# EAGLE design pinoccio-motion (EAGLE 7.1.0)
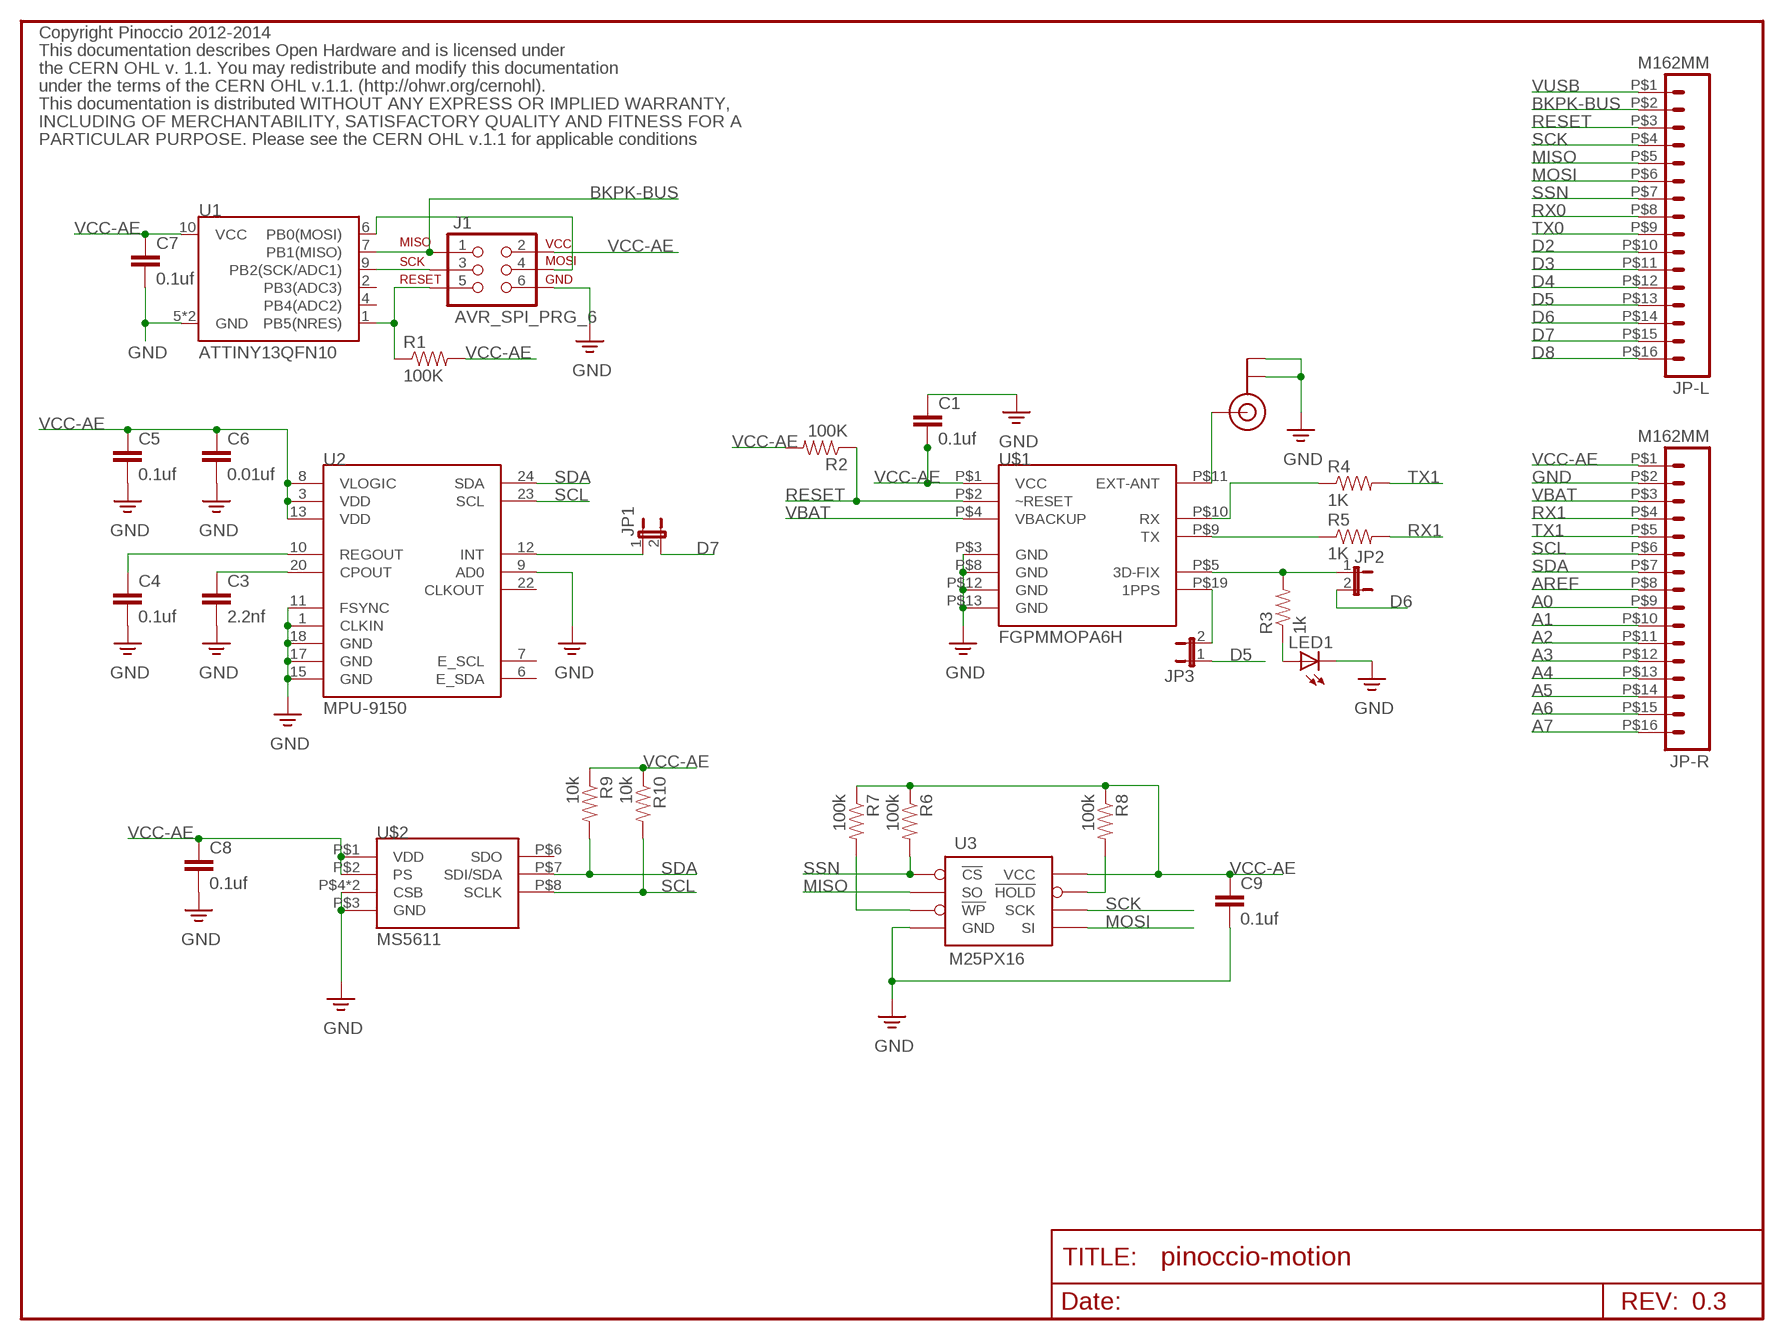
[diagram p0: schematic, sheet 1]

## Parts
C1  0.1uf  CAP0402-CAP  [0402-CAP]
C3  2.2nf  CAP0603-CAP  [0603-CAP]
C4  0.1uf  CAP0402-CAP  [0402-CAP]
C5  0.1uf  CAP0402-CAP  [0402-CAP]
C6  0.01uf  CAP0402-CAP  [0402-CAP]
C7  0.1uf  CAP0402-CAP  [0402-CAP]
C8  0.1uf  CAP0402-CAP  [0402-CAP]
C9  0.1uf  CAP0402-CAP  [0402-CAP]
J1  AVR_SPI_PRG_6  [2X3-PAD]
JP1  JUMPER-2SMD-NC  [SJ_2S]
JP2  JUMPER-2SMD-NC  [SJ_2S]
JP3  JUMPER-2SMD-NC  [SJ_2S]
JP-L  M162MM  [1X16_2MM]
JP-R  M162MM  [1X16_2MM]
LED1  LED0603  [LED-0603]
R1  100K  RESISTOR0402-RES  [0402-RES]
R2  100K  RESISTOR0402-RES  [0402-RES]
R3  1k  RESISTOR0402-RES  [0402-RES]
R4  1K  RESISTOR0402-RES  [0402-RES]
R5  1K  RESISTOR0402-RES  [0402-RES]
R6  100k  RESISTOR0402-RES  [0402-RES]
R7  100k  RESISTOR0402-RES  [0402-RES]
R8  100k  RESISTOR0402-RES  [0402-RES]
R9  10k  RESISTOR0402-RES  [0402-RES]
R10  10k  RESISTOR0402-RES  [0402-RES]
U1  ATTINY13QFN10  [QFN-10]
U2  MPU-9150  MPU-9150QFN-24-NP  [QFN-24-NP]
U3  M25PX16  M25PX16SO8N  [SO8N]
U$1  FGPMMOPA6H  [FGPMMOPA6H]
U$2  MS5611  [MS5611]
U$4  U.FL  [U.FL]

## Nets
A0: JP-R.P$9
A1: JP-R.P$10
A2: JP-R.P$11
A3: JP-R.P$12
A4: JP-R.P$13
A5: JP-R.P$14
A6: JP-R.P$15
A7: JP-R.P$16
AREF: JP-R.P$8
BKPK-BUS: J1.1 JP-L.P$2 U1.7(PB1(MISO))
D2: JP-L.P$10
D3: JP-L.P$11
D4: JP-L.P$12
D5: JP3.1 JP-L.P$13
D6: JP2.2 JP-L.P$14
D7: JP1.2 JP-L.P$15
D8: JP-L.P$16
GND [GND]: C1.1 C3.2 C4.2 C5.2 C6.2 C7.2 C8.2 C9.2 J1.6 JP-R.P$2 LED1.C U1.5(GND) U1.EP(GND) U2.1(CLKIN) U2.9(AD0) U2.11(FSYNC) U2.15(GND) U2.17(GND) U2.18(GND) U3.4(GND) U$1.P$3(GND) U$1.P$8(GND) U$1.P$12(GND) U$1.P$13(GND) U$2.P$3(GND) U$2.P$4(CSB) U$2.P$5(CSB) U$4.P$1(GND) U$4.P$2(GND)
MISO: JP-L.P$5 U3.2(SO)
MOSI: JP-L.P$6 U3.5(SI)
N$1: J1.4 U1.6(PB0(MOSI))
N$2: R4.1 U$1.P$10(RX)
N$3: J1.3 U1.9(PB2(SCK/ADC1))
N$4: J1.5 R1.1 U1.1(PB5(NRES))
N$5: U$1.P$11(EXT-ANT) U$4.P$3(SIGNAL)
N$6: R5.1 U$1.P$9(TX)
N$7: JP1.1 U2.12(INT)
N$8: C3.1 U2.20(CPOUT)
N$9: JP2.1 R3.2 U$1.P$5(3D-FIX)
N$10: JP3.2 U$1.P$19(1PPS)
N$11: C4.1 U2.10(REGOUT)
N$12: R7.2 U3.3(!WP)
N$13: R8.2 U3.7(!HOLD)
N$14: LED1.A R3.1
RESET: JP-L.P$3 R2.1 U$1.P$2(~RESET)
RX0: JP-L.P$8
RX1: JP-R.P$4 R5.2
SCK: JP-L.P$4 U3.6(SCK)
SCL: JP-R.P$6 R10.2 U2.23(SCL) U$2.P$8(SCLK)
SDA: JP-R.P$7 R9.2 U2.24(SDA) U$2.P$7(SDI/SDA)
SSN: JP-L.P$7 R6.2 U3.1(!CS)
TX0: JP-L.P$9
TX1: JP-R.P$5 R4.2
VBAT: JP-R.P$3 U$1.P$4(VBACKUP)
VCC-AE: C1.2 C5.1 C6.1 C7.1 C8.1 C9.1 J1.2 JP-R.P$1 R1.2 R2.2 R6.1 R7.1 R8.1 R9.1 R10.1 U1.10(VCC) U2.3(VDD) U2.8(VLOGIC) U2.13(VDD) U3.8(VCC) U$1.P$1(VCC) U$2.P$1(VDD) U$2.P$2(PS)
VUSB: JP-L.P$1
Unconnected: U1.2(PB3(ADC3)) U1.4(PB4(ADC2)) U2.6(E_SDA) U2.7(E_SCL) U2.22(CLKOUT) U$2.P$6(SDO)

## Notes on the sheet
- Copyright Pinoccio 2012-2014
- This documentation describes Open Hardware and is licensed under
- the CERN OHL v. 1.1. You may redistribute and modify this documentation
- under the terms of the CERN OHL v.1.1. (http://ohwr.org/cernohl).
- This documentation is distributed WITHOUT ANY EXPRESS OR IMPLIED WARRANTY,
- INCLUDING OF MERCHANTABILITY, SATISFACTORY QUALITY AND FITNESS FOR A
- PARTICULAR PURPOSE. Please see the CERN OHL v.1.1 for applicable conditions
- 0.3
- /Volumes/Data/Users/eric/Desktop/pinoccio.bmp
- /Volumes/Data/Users/eric/Desktop/pinoccio-1in.bmp | /Volumes/Data/Users/eric/Desktop/pinoccio-full-3-4in.bmp | /Volumes/Data/Users/eric/Desktop/pinoccio-full-3-4in.bmp

## Library data of the parts
C1 C3-C9 = Pinoccio:CAP: Capacitor Standard 0603 ceramic capacitor, and 0.1" leaded capacitor.
J1 = Pinoccio:AVR_SPI_PRG_6: AVR ISP 6 Pin This is the reduced ISP connector for AVR programming. Common on Arduino. This footprint will take up less PCB space and can be used with a 10-pin to 6-pin adapter such as SKU: BOB-08508
JP1-JP3 = Pinoccio:JUMPER-2: Jumper Basic 0.1" spaced jumper. Use with breakaway headers.
JP-L JP-R = Pinoccio:M16
LED1 = Pinoccio:LED: LEDs Standard schematic elements and footprints for 5mm, 3mm, 1206, and 0603 sized LEDs. 5mm - Spark Fun Electronics SKU : COM-00529 (and others)
R1-R10 = Pinoccio:RESISTOR: Resistor Basic schematic elements and footprints for 0603, 1206, and PTH resistors.
U1 = Pinoccio:ATTINY13
U2 = Pinoccio:MPU-9150: 9DOF (3mag, 3accel, 3rotat). I2C interface.
U3 = Pinoccio:M25PX16
U$1 = Pinoccio:FGPMMOPA6H
U$2 = Pinoccio:MS5611
U$4 = Pinoccio:U.FL: Hirose U.FL-R-SMT-1(10)

## Net classes
0 Default: width 0.203 mm
1 VCC: width 0.305 mm
2 LEDPower: width 0.203 mm
3 ButtonSignal: width 0.203 mm
4 RF Antenna: width 0.305 mm
5 GND: width 0.203 mm

## Board
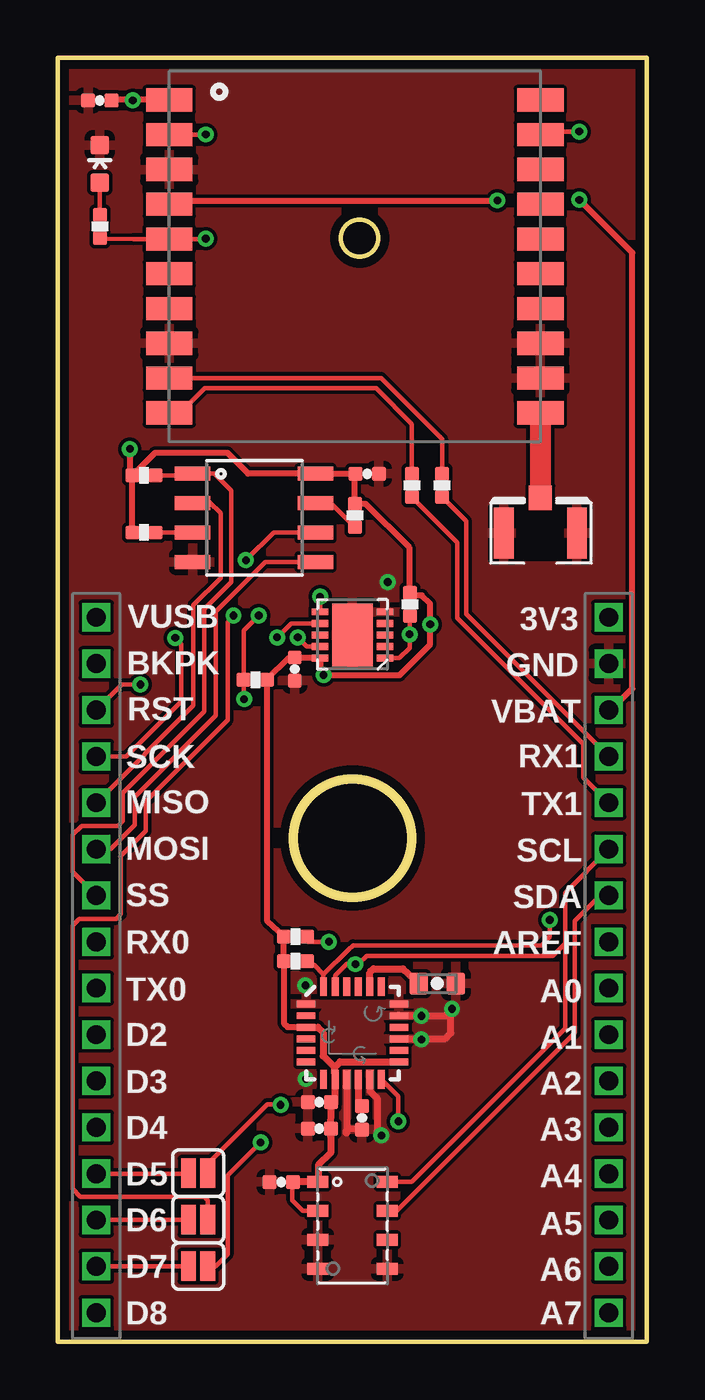
[diagram p1: board, top side]
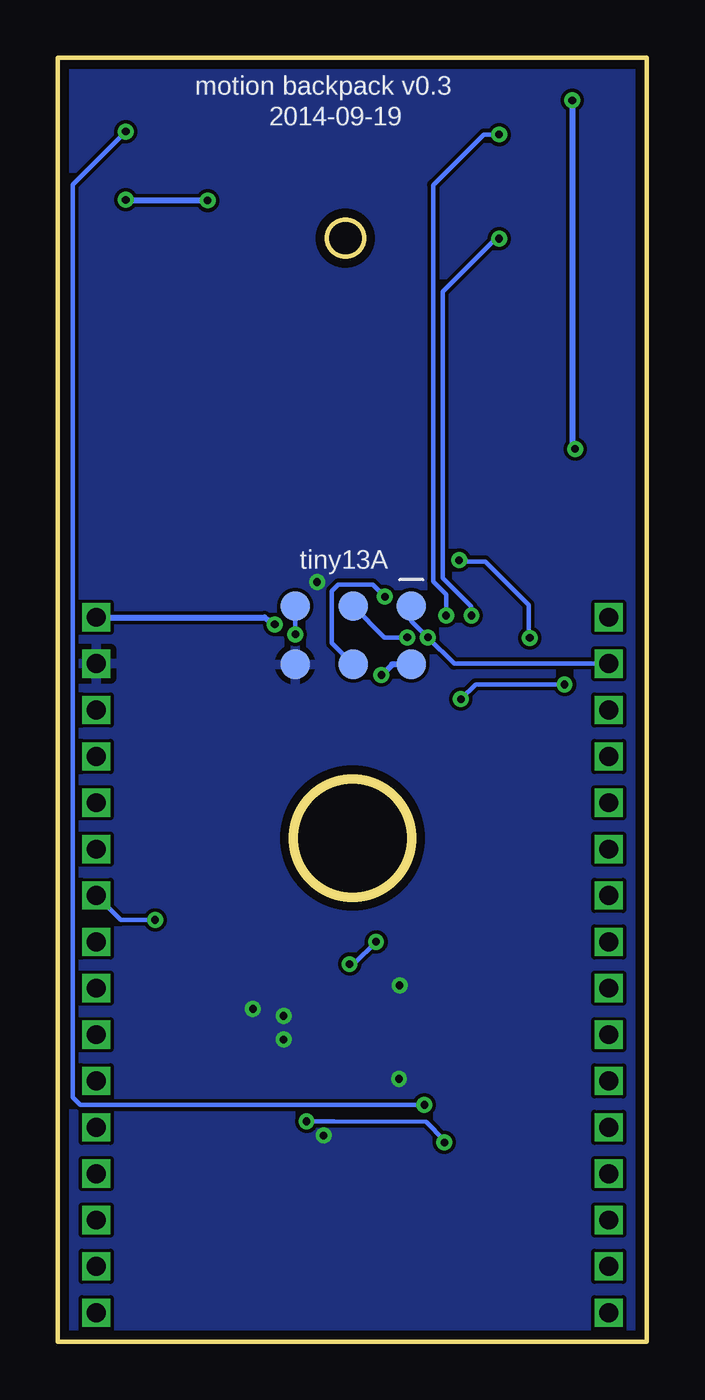
[diagram p2: board, bottom side, seen from below]

Size 25.4 x 55.37 mm. Coordinates in mm from the lower left corner, seen from the top.
Outline: 0,0 0,55.37 25.4,55.37 25.4,0 0.03,0
Outline: circle at 12.7,21.72 radius 2.54
Outline: circle at 13,47.6 radius 0.79
Copper layers (1*16): Top 0.0356mm / dielectric 1.5011mm / Bottom 0.0356mm
Design rules "default": minimum track width 6mil, minimum drill 13mil, track to track 6mil, track to pad 6mil, pad to pad 6mil, via to via 6mil, smd to smd 6mil, copper to edge 15mil, drill to drill 6mil, minimum pad ring 7mil, minimum via ring 7mil, stop-mask expansion 4mil, vias tented up to drill 16mil, thermal gap 10mil

### Footprints (pad centres in the part's own frame; a part is rotated, then mirrored left to right if it is on the bottom)
0402-CAP = smd 0.6 x 0.6: 1 -0.5,0; 2 0.5,0
0603-CAP = smd 0.8 x 0.95: 1 -0.8,0; 2 0.8,0
2X3-PAD = smd 1.27 x 1.27: 1 0,0; 2 0,2.508; 3 2.508,0; 4 2.508,2.508; 5 5.016,0; 6 5.016,2.508
SJ_2S = smd 0.635 x 1.27: 1 -0.412,0; 2 0.412,0
1X16_2MM = drill 0.813 square: P$1 0,0; P$2 2,0; P$3 4,0; P$4 6,0; P$5 8,0; P$6 10,0; P$7 12,0; P$8 14,0; P$9 16,0; P$10 18,0; P$11 20,0; P$12 22,0; P$13 24,0; P$14 26,0; P$15 28,0; P$16 30,0
LED-0603 = smd 0.8 x 0.8: A 0,-0.8; C 0,0.8
0402-RES = smd 0.6 x 0.6: 1 -0.5,0; 2 0.5,0
QFN-10 = smd 0.7 x 0.3: 1 -1.4,1; 2 -1.4,0.5; 3 -1.4,0; 4 -1.4,-0.5; 5 -1.4,-1; 6 1.4,-1; 7 1.4,-0.5; 8 1.4,0; 9 1.4,0.5; 10 1.4,1 | smd 1.75 x 2.7: EP 0,0
QFN-24-NP = smd 0.8 x 0.3: 1 -2,1.25; 2 -2,0.75; 3 -2,0.25; 4 -2,-0.25; 5 -2,-0.75; 6 -2,-1.25; 13 2,-1.25; 14 2,-0.75; 15 2,-0.25; 16 2,0.25; 17 2,0.75; 18 2,1.25 | smd 0.3 x 0.8: 7 -1.25,-2; 8 -0.75,-2; 9 -0.25,-2; 10 0.25,-2; 11 0.75,-2; 12 1.25,-2; 19 1.25,2; 20 0.75,2; 21 0.25,2; 22 -0.25,2; 23 -0.75,2; 24 -1.25,2
SO8N = smd 0.61 x 1.524: 1 -1.905,-2.678; 2 -0.635,-2.678; 3 0.635,-2.678; 4 1.905,-2.678; 5 1.905,2.621; 6 0.635,2.621; 7 -0.635,2.621; 8 -1.905,2.621
FGPMMOPA6H = smd 2 x 1: P$1 0,14.75; P$2 0,13.25; P$3 0,11.75; P$4 0,10.25; P$5 0,8.75; P$6 0,7.25; P$7 0,5.75; P$8 0,4.25; P$9 0,2.75; P$10 0,1.25; P$11 16,1.25; P$12 16,2.75; P$13 16,4.25; P$14 16,5.75; P$15 16,7.25; P$16 16,8.75; P$17 16,10.25; P$18 16,11.75; P$19 16,13.25; P$20 16,14.75
MS5611 = smd 0.9 x 0.5: P$1 0,4.4; P$2 0,3.15; P$3 0,1.9; P$4 0,0.65; P$5 3,0.65; P$6 3,1.9; P$7 3,3.15; P$8 3,4.4
U.FL = smd 2.2 x 0.85: P$1 0,1.575; P$2 0,-1.575 | smd 1.05 x 1: P$3 1.525,0

### Placement (x,y rotation side)
C1  1.8,53.54 0 top
C3  16.36,15.44 0 top
C4  13.11,9.65 270 top
C5  11.28,9.19 180 top
C6  11.28,10.34 180 top
C7  10.21,29.01 270 top
C8  9.63,6.88 180 top
C9  13.34,37.44 0 top
J1  10.16,31.72 180 bottom
JP1  6.05,3.25 180 top
JP2  6.05,5.26 180 top
JP3  6.05,7.26 0 top
JP-L  1.65,31.24 270 top
JP-R  23.75,31.24 270 top
LED1  1.8,50.8 0 top
R1  15.19,31.8 90 top
R2  8.51,28.55 0 top
R3  1.8,48.11 270 top
R4  15.27,36.93 270 top
R5  16.56,36.93 270 top
R6  3.71,37.36 0 top
R7  3.71,34.9 0 top
R8  12.8,35.64 270 top
R9  10.24,16.41 0 top
R10  10.24,17.48 0 top
U1  12.7,30.48 180 top
U2  12.7,13.31 0 top
U3  8.48,35.53 270 top
U$1  4.8,38.81 0 top
U$2  11.2,2.49 0 top
U$4  20.8,34.87 90 top

### Tracks (layer width: path | path; a pad name or v marks a point on that pad's centre or on a via)
BKPK-BUS  (via drill 0.33)
  Top 0.203: U1.7 10.05,30.98 v9.45,30.38
  Bottom 0.203: J1.1 10.16,31.09 v9.45,30.38 8.31,29.24 JP-L.P$2
D5
  Top 0.203: JP-L.P$13 5.63,7.24 JP3.1
D6
  Top 0.203: JP2.2 5.52,5.24 JP-L.P$14
D7
  Top 0.203: JP-L.P$15 5.6,3.24 JP1.2
GND  (via drill 0.33)
  Top 0.305: 13.77,8.91 v13.95,8.89 13.77,9.07 13.77,10.49 13.45,10.81 U2.11 | 12.43,9.07 12.42,9.02 12.45,8.99 12.45,9.14 | 12.45,11.03 12.42,11 | 14.69,14.07 U2.17 15.48,14.06 15.49,14.05 16.69,14.05 v16.99,14.35 16.94,14.3 16.94,13.31 16.69,13.06 U2.15 | 12.45,11.03 12.45,9.14 | U2.9 12.45,11.03 | C4.2 12.48,9.18 12.45,9.14
  other vias: 10.69,11.33 15.67,14.05 15.67,13.03 14.22,32.77 10.67,15.37
  pour Top: 0.08,42.82 0.03,42.82 -0.03,0.08 25.32,0.08 25.35,0.1 25.37,55.37 0.08,55.37
  pour Bottom: 0.08,42.65 0.03,42.65 -0.03,0.08 24.84,0.05 25.3,0.05 25.32,0.51 25.37,55.37 0.1,55.37
MISO
  Top 0.203: 5.86,36.12 U3.2 5.86,36.22 6.53,36.22 7.01,35.74 7.01,32.94 5.84,31.77 5.84,27.43 JP-L.P$5
MOSI
  Top 0.203: JP-L.P$6 2.27,21.24 3.3,22.28 3.3,23.5 6.81,27 6.81,31.5 8.94,33.63 U3.5
N$1  (via drill 0.33)
  Top 0.203: U1.6 11.3,31.96 v11.3,32.13
  Bottom 0.203: v11.3,32.13 11.84,32.66 13.31,32.66 13.59,32.38 13.59,30.12 J1.4
N$2
  Top 0.203: U$1.P$10 5.42,40.21 6.33,41.12 13.72,41.12 15.27,39.57 R4.1
N$3  (via drill 0.33)
  Top 0.203: U1.9 10.74,29.98 v10.34,30.38
  Bottom 0.203: v10.34,30.38 11.32,30.38 J1.3
N$4  (via drill 0.33)
  Top 0.203: R1.1 15.16,31.27 v15.16,30.51 15.16,29.92 14.72,29.48 U1.1
  Bottom 0.203: J1.5 15.18,30.52 v15.16,30.51
N$5
  Top 0.914: U$1.P$11 20.8,39.83 U$4.P$3
N$6
  Top 0.203: U$1.P$9 13.94,41.56 16.56,38.94 R5.1
N$7  (via drill 0.33)
  Top 0.203: U2.12 14.68,10.58 v14.68,9.5 | v8.74,8.59 7.32,7.16 7.32,3.76 6.81,3.25 JP1.1
  Bottom 0.203: v14.68,9.5 13.49,9.5 9.53,9.47 8.74,8.69 v8.74,8.59
N$8
  Top 0.305: U2.20 13.45,15.91 13.61,16.08 14.87,16.08 C3.1
N$9  (via drill 0.33)
  Top 0.203: v7.57,31.32 7.32,31.04 7.32,26.82 3.79,23.29 3.79,22.02 2.69,20.93 2.72,20.9 2.72,18.44 2.52,18.24 0.91,18.24 0.64,17.96 0.64,6.58 0.96,6.25 6.3,6.25 6.45,6.1 JP2.1 | 4.81,47.73 U$1.P$5 | R3.2 2.11,47.58 3.25,47.56 U$1.P$5 | U$1.P$5 6.36,47.56 v6.38,47.57
  Bottom 0.203: v7.57,31.32 7.57,31.7 8.81,32.94 8.81,45.29 6.53,47.57 v6.38,47.57
N$10  (via drill 0.33)
  Top 0.203: v22.48,52.2 20.82,52.2 U$1.P$19 | v9.6,10.21 9.58,10.24 9.02,10.24 6.58,7.8 6.58,7.39 JP3.2
  Bottom 0.203: v22.48,52.2 24.77,49.91 24.77,10.54 24.43,10.21 v9.6,10.21 9.63,10.24
N$11
  Top 0.305: 12.95,9.98 C4.1 12.95,10.33 U2.10
N$12
  Top 0.203: R7.2 U3.3
N$13
  Top 0.203: U3.7 11.77,36.17 R8.2
N$14
  Top 0.203: LED1.A R3.1
RESET  (via drill 0.33)
  Top 0.203: JP-L.P$3 2.75,28.35 v3.56,28.35 | v8.03,27.71 8.01,27.73 R2.1 8.01,30.67 v8.66,31.32 | 4.81,52.22 U$1.P$2 v6.38,52.07
  Bottom 0.203: v3.56,28.35 7.39,28.35 v8.03,27.71 | v8.66,31.32 8.66,32.23 9.22,32.79 9.22,49.89 7.04,52.07 v6.38,52.07
RX1
  Top 0.203: JP-R.P$4 17.6,31.39 17.6,35.39 R5.2
SCK  (via drill 0.33)
  Top 0.203: 10.67,34.9 U3.6 9.3,34.9 v8.1,33.71 | JP-L.P$4 2.94,25.24 5.31,27.61 5.31,30.1 v5.05,30.35
  Bottom 0.203: v5.05,30.35 5.11,30.35 5.11,31.77 6.99,33.66 8.1,33.66 v8.1,33.71
SCL  (via drill 0.33)
  Top 0.203: JP-R.P$6 21.87,19.36 21.87,17.17 | U2.23 11.95,15.79 12.45,16.28 v12.83,16.28 12.95,16.28 13.31,16.64 21.34,16.64 21.87,17.17 | R10.2 10.79,17.25 v11.68,17.25 | 21.87,17.17 21.87,13.51 15.25,6.89 U$2.P$8
  Bottom 0.203: v11.68,17.25 12.65,16.28 v12.83,16.28
SDA  (via drill 0.33)
  Top 0.203: JP-R.P$7 23.75,19.18 23.32,19.18 22.28,18.14 22.28,13.31 14.61,5.64 U$2.P$7 | 11.45,15.84 12.52,16.89 12.72,17.09 20.85,17.09 21.21,17.45 v21.21,18.19 21.18,18.21 | 11.45,15.84 U2.24 | R9.2 11.06,16.23 11.45,15.84
  Bottom 0.203: JP-R.P$7 22.69,18.19 v21.21,18.19
SSN
  Top 0.203: R6.2 5.73,37.36 U3.1 6.73,37.44 7.47,36.7 7.47,32.77 6.3,31.6 6.3,27.18 2.79,23.67 2.79,22.45 2.59,22.25 1.02,22.25 0.64,21.87 0.64,20.26 JP-L.P$7
TX1
  Top 0.203: JP-R.P$5 22.66,24.33 22.66,25.78 17.22,31.22 17.22,34.48 R4.2
VBAT  (via drill 0.33)
  Top 0.254: JP-R.P$3 23.84,27.24 24.77,28.17 24.77,46.97 v22.48,49.25 | U$1.P$4 4.81,49.23 v18.95,49.23
  Bottom 0.254: 22.5,49.23 v22.48,49.25 22.45,49.23 v18.95,49.23
VCC-AE  (via drill 0.33)
  Top 0.203: U$2.P$2 10.57,5.64 10.11,6.1 10.11,6.87 C8.1
  Top 0.254: R6.1 4.17,38.33 7.32,38.33 8.2,37.44 U3.8 C9.1 12.8,37.41 R8.1 12.81,36.14 13.26,36.14 15.14,34.27 15.14,32.35 R1.2 15.31,32.18 15.7,32.18 16.05,31.83 v16.05,30.94 16.05,30.07 14.73,28.75 v11.46,28.75 11.3,28.91 U1.10 10.24,29.48 C7.1 9.97,29.51 R2.2 9.01,18.15 R10.1 9.73,17.19 9.73,16.33 9.74,16.32 R9.1 9.74,13.73 9.91,13.56 U2.3 | R7.1 R6.1 | v3.1,38.51 3.1,37.47 R6.1 | U$1.P$1 3.24,53.56 | 3.24,53.56 v3.23,53.54 | 3.24,53.56 2.32,53.56 C1.2
  Top 0.305: C6.1 11.93,10.23 11.95,10.26 U2.8 11.93,11.77 11.93,11.82 | 11.78,10.03 C6.1 | 11.93,11.82 12.17,12.07 U2.13 | U2.3 11.21,13.56 11.43,13.34 11.43,12.32 11.93,11.82 | C6.1 11.75,8.86 C5.1 11.78,8.17 11.25,7.64 11.25,6.94 U$2.P$1 C8.1
  Bottom 0.254: JP-R.P$1 16.48,31.24 v16.05,30.94 | 9.68,29.22 J1.2 10.99,29.22 v11.46,28.75 | v3.23,53.54 3.23,38.63 v3.1,38.51

### Text on the board
tPlace: 3V3 | VUSB | GND | BKPK | VBAT | RST | RX1 | SCK | TX1 | MISO | SCL | MOSI | SDA | SS | AREF | RX0 | A0 | TX0 | A1 | D2 | A2 | D3 | A3 | D4 | A4 | D5 | A5 | D6 | A6 | D7 | A7 | D8
bPlace: motion backpack v0.3 | 2014-09-19 | tiny13A
tDocu: Pinoccio(tm) Motion Backpack v0.3 | Design by: Eric Jennings for Pinoccio | http://pinocc.io | Licensed under CERN OHL v.1.1